# EAGLE schematic Arduino keyboard schematic (EAGLE 7.4.0)
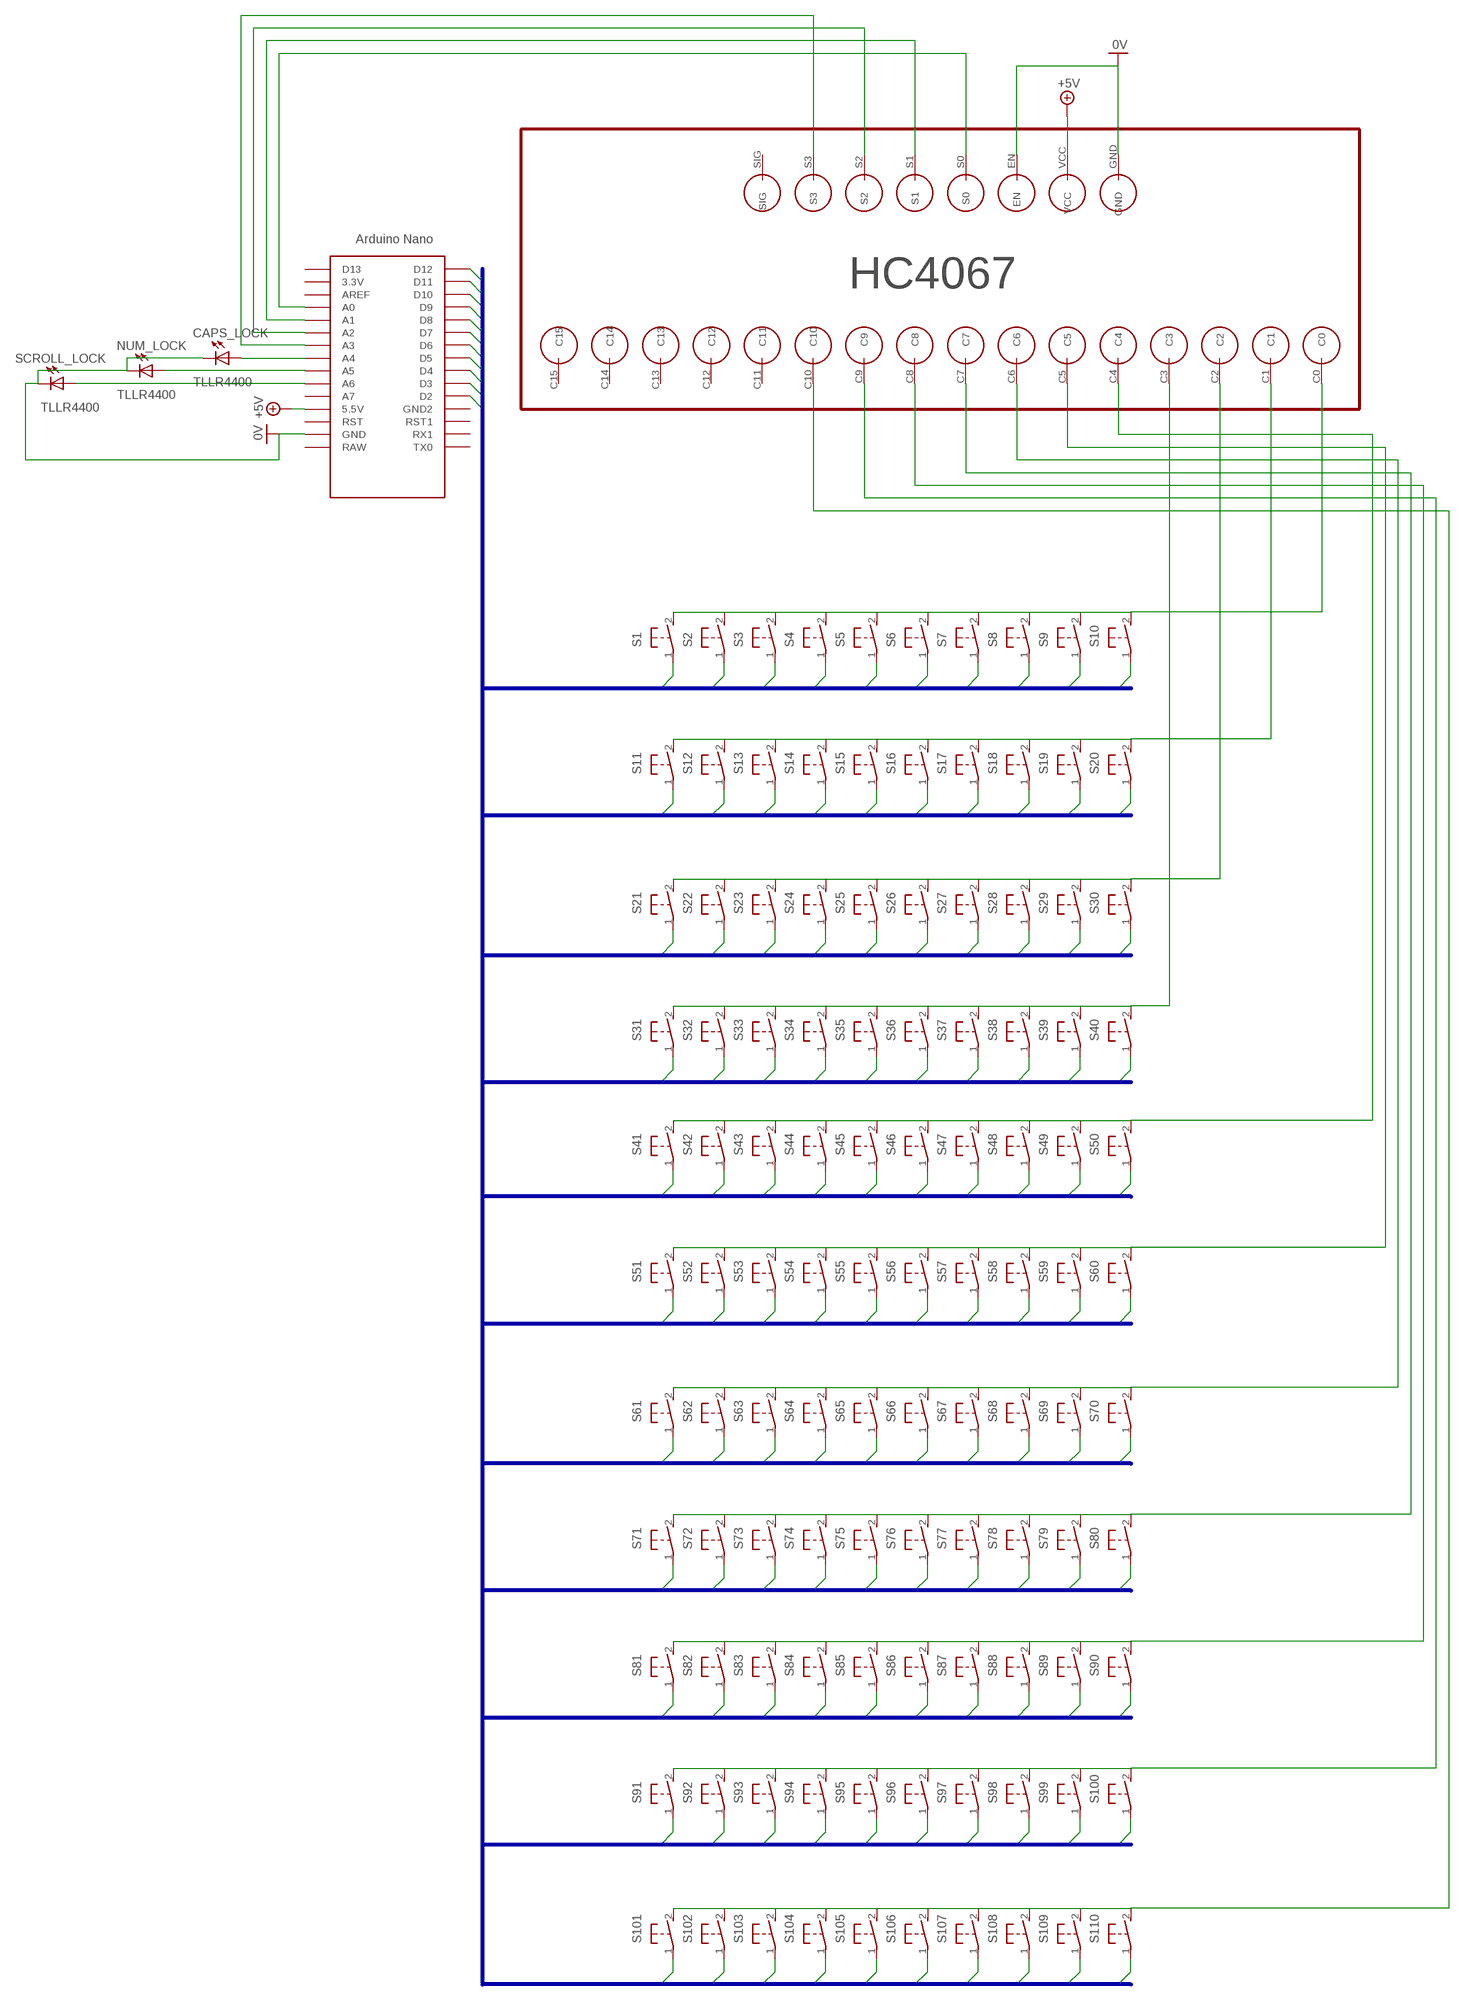
[diagram p0: schematic, sheet 1]

## Parts
CAPS_LOCK  TLLR4400  [LED3MM]
NUM_LOCK  TLLR4400  [LED3MM]
S1  31-XX  [B3F-31XX]
S2  31-XX  [B3F-31XX]
S3  31-XX  [B3F-31XX]
S4  31-XX  [B3F-31XX]
S5  31-XX  [B3F-31XX]
S6  31-XX  [B3F-31XX]
S7  31-XX  [B3F-31XX]
S8  31-XX  [B3F-31XX]
S9  31-XX  [B3F-31XX]
S10  31-XX  [B3F-31XX]
S11  31-XX  [B3F-31XX]
S12  31-XX  [B3F-31XX]
S13  31-XX  [B3F-31XX]
S14  31-XX  [B3F-31XX]
S15  31-XX  [B3F-31XX]
S16  31-XX  [B3F-31XX]
S17  31-XX  [B3F-31XX]
S18  31-XX  [B3F-31XX]
S19  31-XX  [B3F-31XX]
S20  31-XX  [B3F-31XX]
S21  31-XX  [B3F-31XX]
S22  31-XX  [B3F-31XX]
S23  31-XX  [B3F-31XX]
S24  31-XX  [B3F-31XX]
S25  31-XX  [B3F-31XX]
S26  31-XX  [B3F-31XX]
S27  31-XX  [B3F-31XX]
S28  31-XX  [B3F-31XX]
S29  31-XX  [B3F-31XX]
S30  31-XX  [B3F-31XX]
S31  31-XX  [B3F-31XX]
S32  31-XX  [B3F-31XX]
S33  31-XX  [B3F-31XX]
S34  31-XX  [B3F-31XX]
S35  31-XX  [B3F-31XX]
S36  31-XX  [B3F-31XX]
S37  31-XX  [B3F-31XX]
S38  31-XX  [B3F-31XX]
S39  31-XX  [B3F-31XX]
S40  31-XX  [B3F-31XX]
S41  31-XX  [B3F-31XX]
S42  31-XX  [B3F-31XX]
S43  31-XX  [B3F-31XX]
S44  31-XX  [B3F-31XX]
S45  31-XX  [B3F-31XX]
S46  31-XX  [B3F-31XX]
S47  31-XX  [B3F-31XX]
S48  31-XX  [B3F-31XX]
S49  31-XX  [B3F-31XX]
S50  31-XX  [B3F-31XX]
S51  31-XX  [B3F-31XX]
S52  31-XX  [B3F-31XX]
S53  31-XX  [B3F-31XX]
S54  31-XX  [B3F-31XX]
S55  31-XX  [B3F-31XX]
S56  31-XX  [B3F-31XX]
S57  31-XX  [B3F-31XX]
S58  31-XX  [B3F-31XX]
S59  31-XX  [B3F-31XX]
S60  31-XX  [B3F-31XX]
S61  31-XX  [B3F-31XX]
S62  31-XX  [B3F-31XX]
S63  31-XX  [B3F-31XX]
S64  31-XX  [B3F-31XX]
S65  31-XX  [B3F-31XX]
S66  31-XX  [B3F-31XX]
S67  31-XX  [B3F-31XX]
S68  31-XX  [B3F-31XX]
S69  31-XX  [B3F-31XX]
S70  31-XX  [B3F-31XX]
S71  31-XX  [B3F-31XX]
S72  31-XX  [B3F-31XX]
S73  31-XX  [B3F-31XX]
S74  31-XX  [B3F-31XX]
S75  31-XX  [B3F-31XX]
S76  31-XX  [B3F-31XX]
S77  31-XX  [B3F-31XX]
S78  31-XX  [B3F-31XX]
S79  31-XX  [B3F-31XX]
S80  31-XX  [B3F-31XX]
S81  31-XX  [B3F-31XX]
S82  31-XX  [B3F-31XX]
S83  31-XX  [B3F-31XX]
S84  31-XX  [B3F-31XX]
S85  31-XX  [B3F-31XX]
S86  31-XX  [B3F-31XX]
S87  31-XX  [B3F-31XX]
S88  31-XX  [B3F-31XX]
S89  31-XX  [B3F-31XX]
S90  31-XX  [B3F-31XX]
S91  31-XX  [B3F-31XX]
S92  31-XX  [B3F-31XX]
S93  31-XX  [B3F-31XX]
S94  31-XX  [B3F-31XX]
S95  31-XX  [B3F-31XX]
S96  31-XX  [B3F-31XX]
S97  31-XX  [B3F-31XX]
S98  31-XX  [B3F-31XX]
S99  31-XX  [B3F-31XX]
S100  31-XX  [B3F-31XX]
S101  31-XX  [B3F-31XX]
S102  31-XX  [B3F-31XX]
S103  31-XX  [B3F-31XX]
S104  31-XX  [B3F-31XX]
S105  31-XX  [B3F-31XX]
S106  31-XX  [B3F-31XX]
S107  31-XX  [B3F-31XX]
S108  31-XX  [B3F-31XX]
S109  31-XX  [B3F-31XX]
S110  31-XX  [B3F-31XX]
SCROLL_LOCK  TLLR4400  [LED3MM]
U$1  NANO  [NANO]
U$2  HC4067_BREAKOUT_BOARD  [ANALOG_MUX_BREAKOUT_HC4067]

## Nets
0V: CAPS_LOCK.K(C) NUM_LOCK.K(C) SCROLL_LOCK.K(C) U$1.GND U$2.EN U$2.GND
+5V: U$1.5V(5.5V) U$2.VCC
D_IN0: S1.1(P) S11.1(P) S21.1(P) S31.1(P) S41.1(P) S51.1(P) S61.1(P) S71.1(P) S81.1(P) S91.1(P) S101.1(P) U$1.D2
D_IN1: S2.1(P) S12.1(P) S22.1(P) S32.1(P) S42.1(P) S52.1(P) S62.1(P) S72.1(P) S82.1(P) S92.1(P) S102.1(P) U$1.D3
D_IN2: S3.1(P) S13.1(P) S23.1(P) S33.1(P) S43.1(P) S53.1(P) S63.1(P) S73.1(P) S83.1(P) S93.1(P) S103.1(P) U$1.D4
D_IN3: S4.1(P) S14.1(P) S24.1(P) S34.1(P) S44.1(P) S54.1(P) S64.1(P) S74.1(P) S84.1(P) S94.1(P) S104.1(P) U$1.D5
D_IN4: S5.1(P) S15.1(P) S25.1(P) S35.1(P) S45.1(P) S55.1(P) S65.1(P) S75.1(P) S85.1(P) S95.1(P) S105.1(P) U$1.D6
D_IN5: S6.1(P) S16.1(P) S26.1(P) S36.1(P) S46.1(P) S56.1(P) S66.1(P) S76.1(P) S86.1(P) S96.1(P) S106.1(P) U$1.D7
D_IN6: S7.1(P) S17.1(P) S27.1(P) S37.1(P) S47.1(P) S57.1(P) S67.1(P) S77.1(P) S87.1(P) S97.1(P) S107.1(P) U$1.D8 U$1.D9
D_IN7: S8.1(P) S18.1(P) S28.1(P) S38.1(P) S48.1(P) S58.1(P) S68.1(P) S78.1(P) S88.1(P) S98.1(P) S108.1(P) U$1.D10
D_IN8: S9.1(P) S19.1(P) S29.1(P) S39.1(P) S49.1(P) S59.1(P) S69.1(P) S79.1(P) S89.1(P) S99.1(P) S109.1(P) U$1.D11
D_IN9: S10.1(P) S20.1(P) S30.1(P) S40.1(P) S50.1(P) S60.1(P) S70.1(P) S80.1(P) S90.1(P) S100.1(P) S110.1(P) U$1.D12
N$1: S1.2(S) S2.2(S) S3.2(S) S4.2(S) S5.2(S) S6.2(S) S7.2(S) S8.2(S) S9.2(S) S10.2(S) U$2.C0
N$2: U$1.A0 U$2.S0
N$3: U$1.A1 U$2.S1
N$4: U$1.A2 U$2.S2
N$5: U$1.A3 U$2.S3
N$6: CAPS_LOCK.A U$1.A4
N$7: NUM_LOCK.A U$1.A5
N$8: SCROLL_LOCK.A U$1.A6
N$9: S11.2(S) S12.2(S) S13.2(S) S14.2(S) S15.2(S) S16.2(S) S17.2(S) S18.2(S) S19.2(S) S20.2(S) U$2.C1
N$10: S21.2(S) S22.2(S) S23.2(S) S24.2(S) S25.2(S) S26.2(S) S27.2(S) S28.2(S) S29.2(S) S30.2(S) U$2.C2
N$11: S31.2(S) S32.2(S) S33.2(S) S34.2(S) S35.2(S) S36.2(S) S37.2(S) S38.2(S) S39.2(S) S40.2(S) U$2.C3
N$12: S41.2(S) S42.2(S) S43.2(S) S44.2(S) S45.2(S) S46.2(S) S47.2(S) S48.2(S) S49.2(S) S50.2(S) U$2.C4
N$13: S51.2(S) S52.2(S) S53.2(S) S54.2(S) S55.2(S) S56.2(S) S57.2(S) S58.2(S) S59.2(S) S60.2(S) U$2.C5
N$14: S61.2(S) S62.2(S) S63.2(S) S64.2(S) S65.2(S) S66.2(S) S67.2(S) S68.2(S) S69.2(S) S70.2(S) U$2.C6
N$15: S71.2(S) S72.2(S) S73.2(S) S74.2(S) S75.2(S) S76.2(S) S77.2(S) S78.2(S) S79.2(S) S80.2(S) U$2.C7
N$16: S81.2(S) S82.2(S) S83.2(S) S84.2(S) S85.2(S) S86.2(S) S87.2(S) S88.2(S) S89.2(S) S90.2(S) U$2.C8
N$17: S91.2(S) S92.2(S) S93.2(S) S94.2(S) S95.2(S) S96.2(S) S97.2(S) S98.2(S) S99.2(S) S100.2(S) U$2.C9
N$18: S101.2(S) S102.2(S) S103.2(S) S104.2(S) S105.2(S) S106.2(S) S107.2(S) S108.2(S) S109.2(S) S110.2(S) U$2.C10
Unconnected: U$1.3.3V U$1.A7 U$1.AREF U$1.D13 U$1.GND1(GND2) U$1.ICSP1 U$1.ICSP2 U$1.ICSP3 U$1.ICSP4 U$1.ICSP5 U$1.ICSP6 U$1.RAW U$1.RST U$1.RST1 U$1.RX1 U$1.TX0 U$2.C11 U$2.C12 U$2.C13 U$2.C14 U$2.C15 U$2.SIG

## Buses
D_IN[0..9]

## Library data of the parts
CAPS_LOCK NUM_LOCK SCROLL_LOCK = led:TLLR4400: Low Current (2mA) LED 3 mm Tinted Diffused Package color RED Source: Data sheet <http://www.farnell.com/datasheets/391100.pdf>; MF: VISHAY SEMICONDUCTOR; OC_FARNELL: 1612437
S1-S110 = switch-omron:31-XX: OMRON SWITCH; MPN: B3F-3100; OC_FARNELL: 959704; OC_NEWARK: 36M3582
U$1 = Arduino-clone:NANO: Arduino Nano
U$2 = HC4067_breakout_board:HC4067_BREAKOUT_BOARD